# Altium schematic sheet [Archive] Perepherals.SchDoc: [2] - PERIPHERALS
size A4; Author: Sawyer Rempel; Revision: A; SheetNumber: 2; SheetTotal: 3
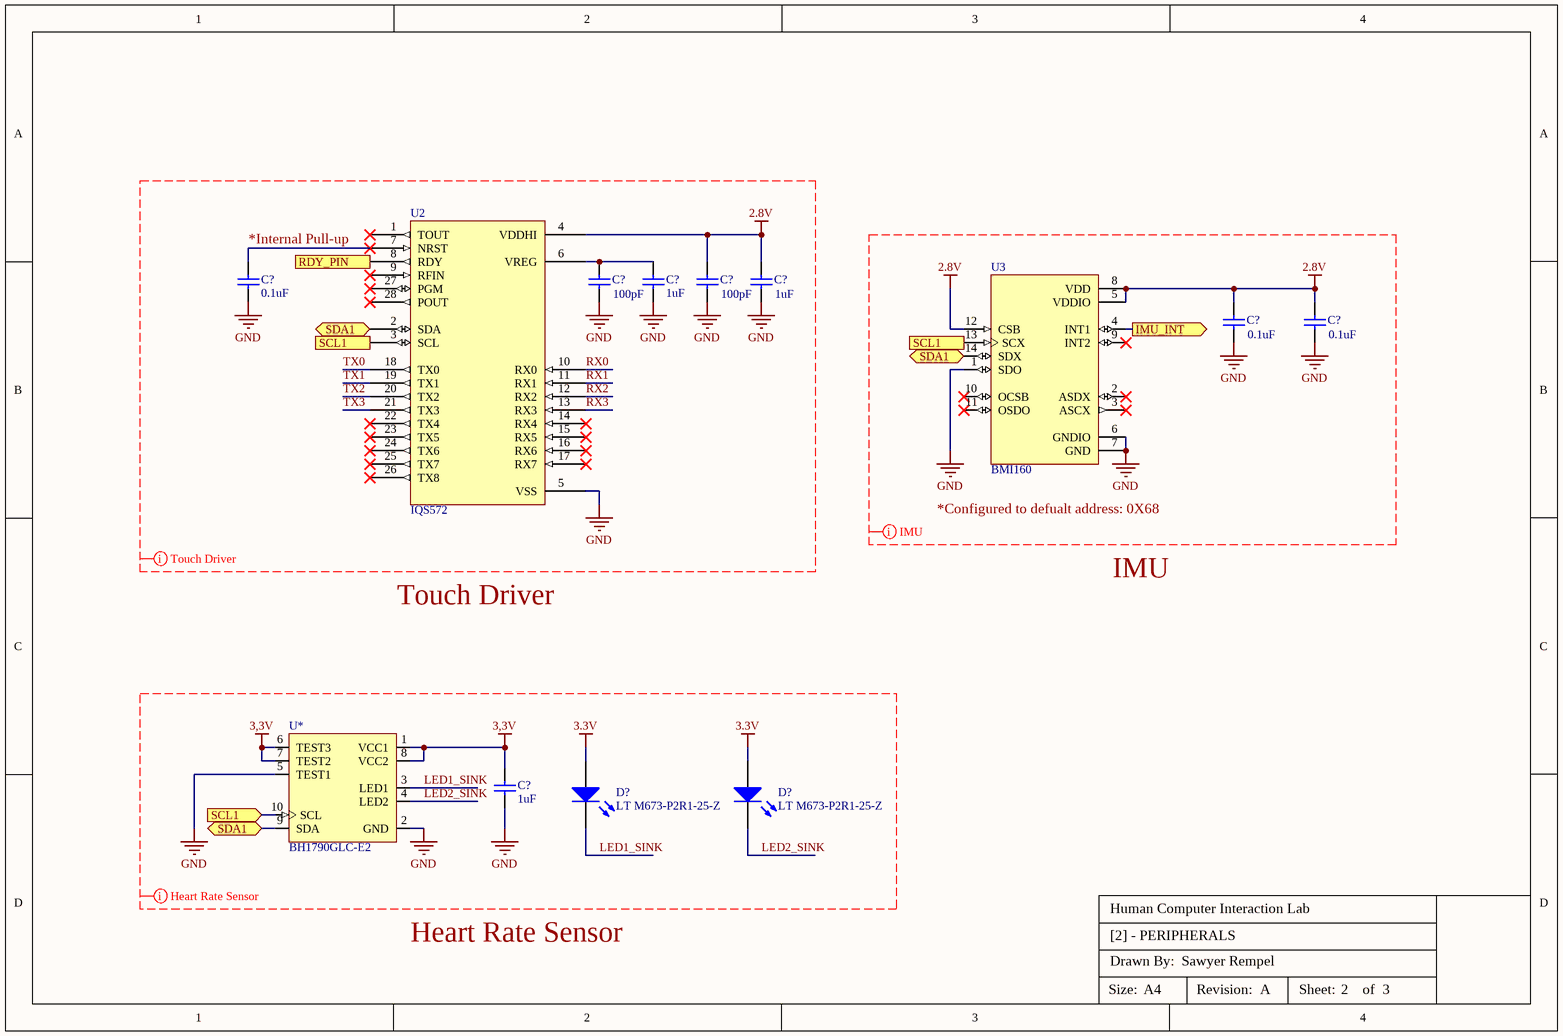
[diagram p0: [Archive] Perepherals.SchDoc]

## Parts
(Parts that share a designator on the sheet are numbered #1, #2 ... from top to bottom, then left to right.)
C?#1  value 0.1uF  [RAD-0.3]  (hidden comment: Cap)
C?#2  value 1uF  [RAD-0.3]  (hidden comment: Cap)
C?#3  value 100pF  [RAD-0.3]  (hidden comment: Cap)
C?#4  value 100pF  [RAD-0.3]  (hidden comment: Cap)
C?#5  value 1uF  [RAD-0.3]  (hidden comment: Cap)
C?#6  value 0.1uF  [RAD-0.3]  (hidden comment: Cap)
C?#7  value 0.1uF  [RAD-0.3]  (hidden comment: Cap)
C?#8  value 1uF  [RAD-0.3]  (hidden comment: Cap)
D?#1  LT M673-P2R1-25-Z  [LED-1]
D?#2  LT M673-P2R1-25-Z  [LED-1]
U2  IQS572  [IQS572]
U3  BMI160  [BMI160]
U*  BH1790GLC-E2  [BH1790GLC-E2]

## Ports
IMU_INT (out), RDY_PIN (out), SCL1 (in), SDA1 (bidir)

## Nets
2.8V: C?#4.2 C?#5.2 C?#6.2 C?#7.2 U2.4(VDDHI) U3.5(VDDIO) U3.8(VDD) U3.12(CSB)
3,3V: C?#8.1 U*.1(VCC1) U*.6(TEST3) U*.7(TEST2) U*.8(VCC2)
3.3V: D?#1.1(A) D?#2.1(A)
GND: C?#1.2 C?#2.2 C?#3.1 C?#4.1 C?#5.1 C?#6.1 C?#7.1 C?#8.2 U2.5(VSS) U3.1(SDO) U3.6(GNDIO) U3.7(GND) U*.2(GND) U*.5(TEST1)
IMU_INT: U3.4(INT1) ; port IMU_INT
LED1_SINK: D?#1.2(K) U*.3(LED1)
LED2_SINK: D?#2.2(K) U*.4(LED2)
RDY_PIN: U2.8(RDY) ; port RDY_PIN
RX0: U2.10(RX0)
RX1: U2.11(RX1)
RX2: U2.12(RX2)
RX3: U2.13(RX3)
SCL1: U2.3(SCL) U3.13(SCX) U*.10(SCL) ; port SCL1
SDA1: U2.2(SDA) U3.14(SDX) U*.9(SDA) ; port SDA1
TX0: U2.18(TX0)
TX1: U2.19(TX1)
TX2: U2.20(TX2)
TX3: U2.21(TX3)
NetC?#1_1: C?#1.1 U2.7(NRST)
NetC?#2_1: C?#2.1 C?#3.2 U2.6(VREG)

Not connected (* = marked no-connect by the designer): U2 1(TOUT)* 9(RFIN)* 14(RX4)* 15(RX5)* 16(RX6)* 17(RX7)* 22(TX4)* 23(TX5)* 24(TX6)* 25(TX7)* 26(TX8)* 27(PGM)* 28(POUT)*; U3 2(ASDX)* 3(ASCX)* 9(INT2)* 10(OCSB)* 11(OSDO)*

## Layout directives
mark named Touch Driver: 2.8V, GND, RX0, RX1, RX2, RX3, TX0, TX1, TX2, TX3
mark named IMU: 2.8V, GND
mark named Heart Rate Sensor: 3,3V, 3.3V, GND, LED1_SINK, LED2_SINK

## Notes on the sheet
- *Internal Pull-up
- (near U3) *Configured to defualt address: 0X68
- IMU
- Touch Driver
- Heart Rate Sensor
- Human Computer Interaction Lab
- Drawn By:
- Size:
- A4
- Revision:
- Sheet:
- of

## Library data of the parts
C?#1-C?#8 = Cap: Capacitor; Published: 8-Jun-2000; LatestRevisionDate: 17-Jul-2002; LatestRevisionNote: Re-released for DXP Platform.; Publisher: Altium Limited; PackageDescription: Radial Cap, Thru-Hole; 2 Leads; 0.3 in Pin Spacing; PackageReference: RAD-0.3
D?#1 D?#2 = LED1: Typical RED GaAs LED; Published: 8-Jun-2000; LatestRevisionDate: 08-Jul-2005; LatestRevisionNote: Mech Layer 1 removed.; PackageReference: LED-1; Publisher: Altium Limited; PackageDescription: LED; 2 Leads
U2 = IQS572: Supplier Part Number: 1790-1047-2-ND